# Altium schematic sheet Sheet1.SchDoc
size A4
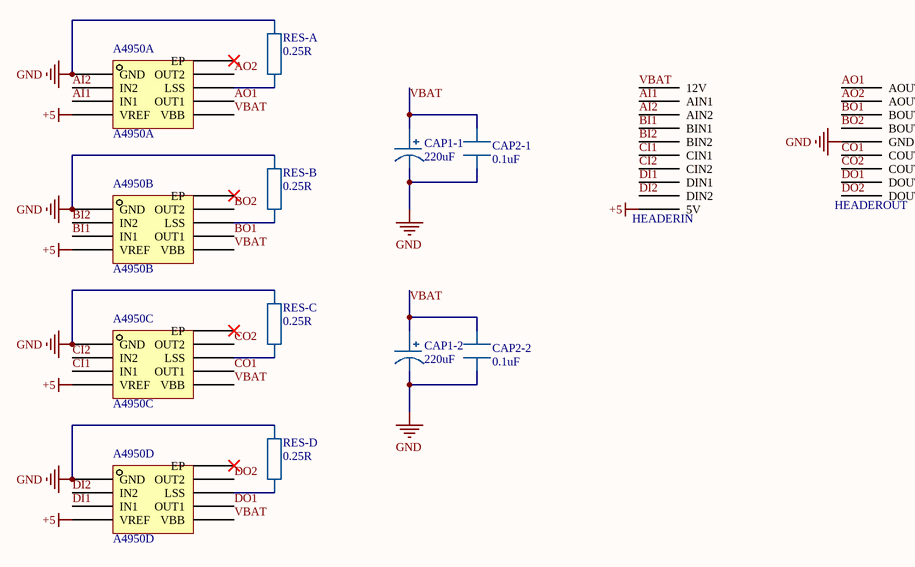
[diagram p0: Sheet1.SchDoc]

## Parts
A4950A  A4950A  [A4950]
A4950B  A4950B  [A4950]
A4950C  A4950C  [A4950]
A4950D  A4950D  [A4950]
CAP1-1  220uF  [CAP1]
CAP1-2  220uF  [CAP1]
CAP2-1  0.1uF  [CAP2]
CAP2-2  0.1uF  [CAP2]
HEADERIN  HEADERIN  [HEADERIN]
HEADEROUT  HEADEROUT  [HEADEROUT]
RES-A  0.25R  [RES2512]
RES-B  0.25R  [RES2512]
RES-C  0.25R  [RES2512]
RES-D  0.25R  [RES2512]

## Nets
+5: A4950A.VREF A4950B.VREF A4950C.VREF A4950D.VREF HEADERIN.5V
GND: A4950A.GND A4950B.GND A4950C.GND A4950D.GND CAP1-1.C- CAP1-2.C- CAP2-1.C1 CAP2-2.C1 HEADEROUT.GND RES-A.R2 RES-B.R2 RES-C.R2 RES-D.R2
AI1: A4950A.IN1 HEADERIN.AIN1
AI2: A4950A.IN2 HEADERIN.AIN2
AO1: A4950A.OUT1 HEADEROUT.AOUT1
AO2: A4950A.OUT2 HEADEROUT.AOUT2
BI1: A4950B.IN1 HEADERIN.BIN1
BI2: A4950B.IN2 HEADERIN.BIN2
BO1: A4950B.OUT1 HEADEROUT.BOUT1
BO2: A4950B.OUT2 HEADEROUT.BOUT2
CI1: A4950C.IN1 HEADERIN.CIN1
CI2: A4950C.IN2 HEADERIN.CIN2
CO1: A4950C.OUT1 HEADEROUT.COUT1
CO2: A4950C.OUT2 HEADEROUT.COUT2
DI1: A4950D.IN1 HEADERIN.DIN1
DI2: A4950D.IN2 HEADERIN.DIN2
DO1: A4950D.OUT1 HEADEROUT.DOUT1
DO2: A4950D.OUT2 HEADEROUT.DOUT2
VBAT: A4950A.VBB A4950B.VBB A4950C.VBB A4950D.VBB CAP1-1.C+ CAP1-2.C+ CAP2-1.C2 CAP2-2.C2 HEADERIN.12V
NetA4950A_LSS: A4950A.LSS RES-A.R1
NetA4950B_LSS: A4950B.LSS RES-B.R1
NetA4950C_LSS: A4950C.LSS RES-C.R1
NetA4950D_LSS: A4950D.LSS RES-D.R1

Not connected (* = marked no-connect by the designer): A4950A EP*; A4950B EP*; A4950C EP*; A4950D EP*

## Library data of the parts
A4950A A4950B A4950C A4950D = A4950
CAP1-1 CAP1-2 = CAP1
CAP2-1 CAP2-2 = CAP2
RES-A RES-B RES-C RES-D = RES